# EAGLE design SparkX_smol_ZOE-M8Q (EAGLE 9.6.2)
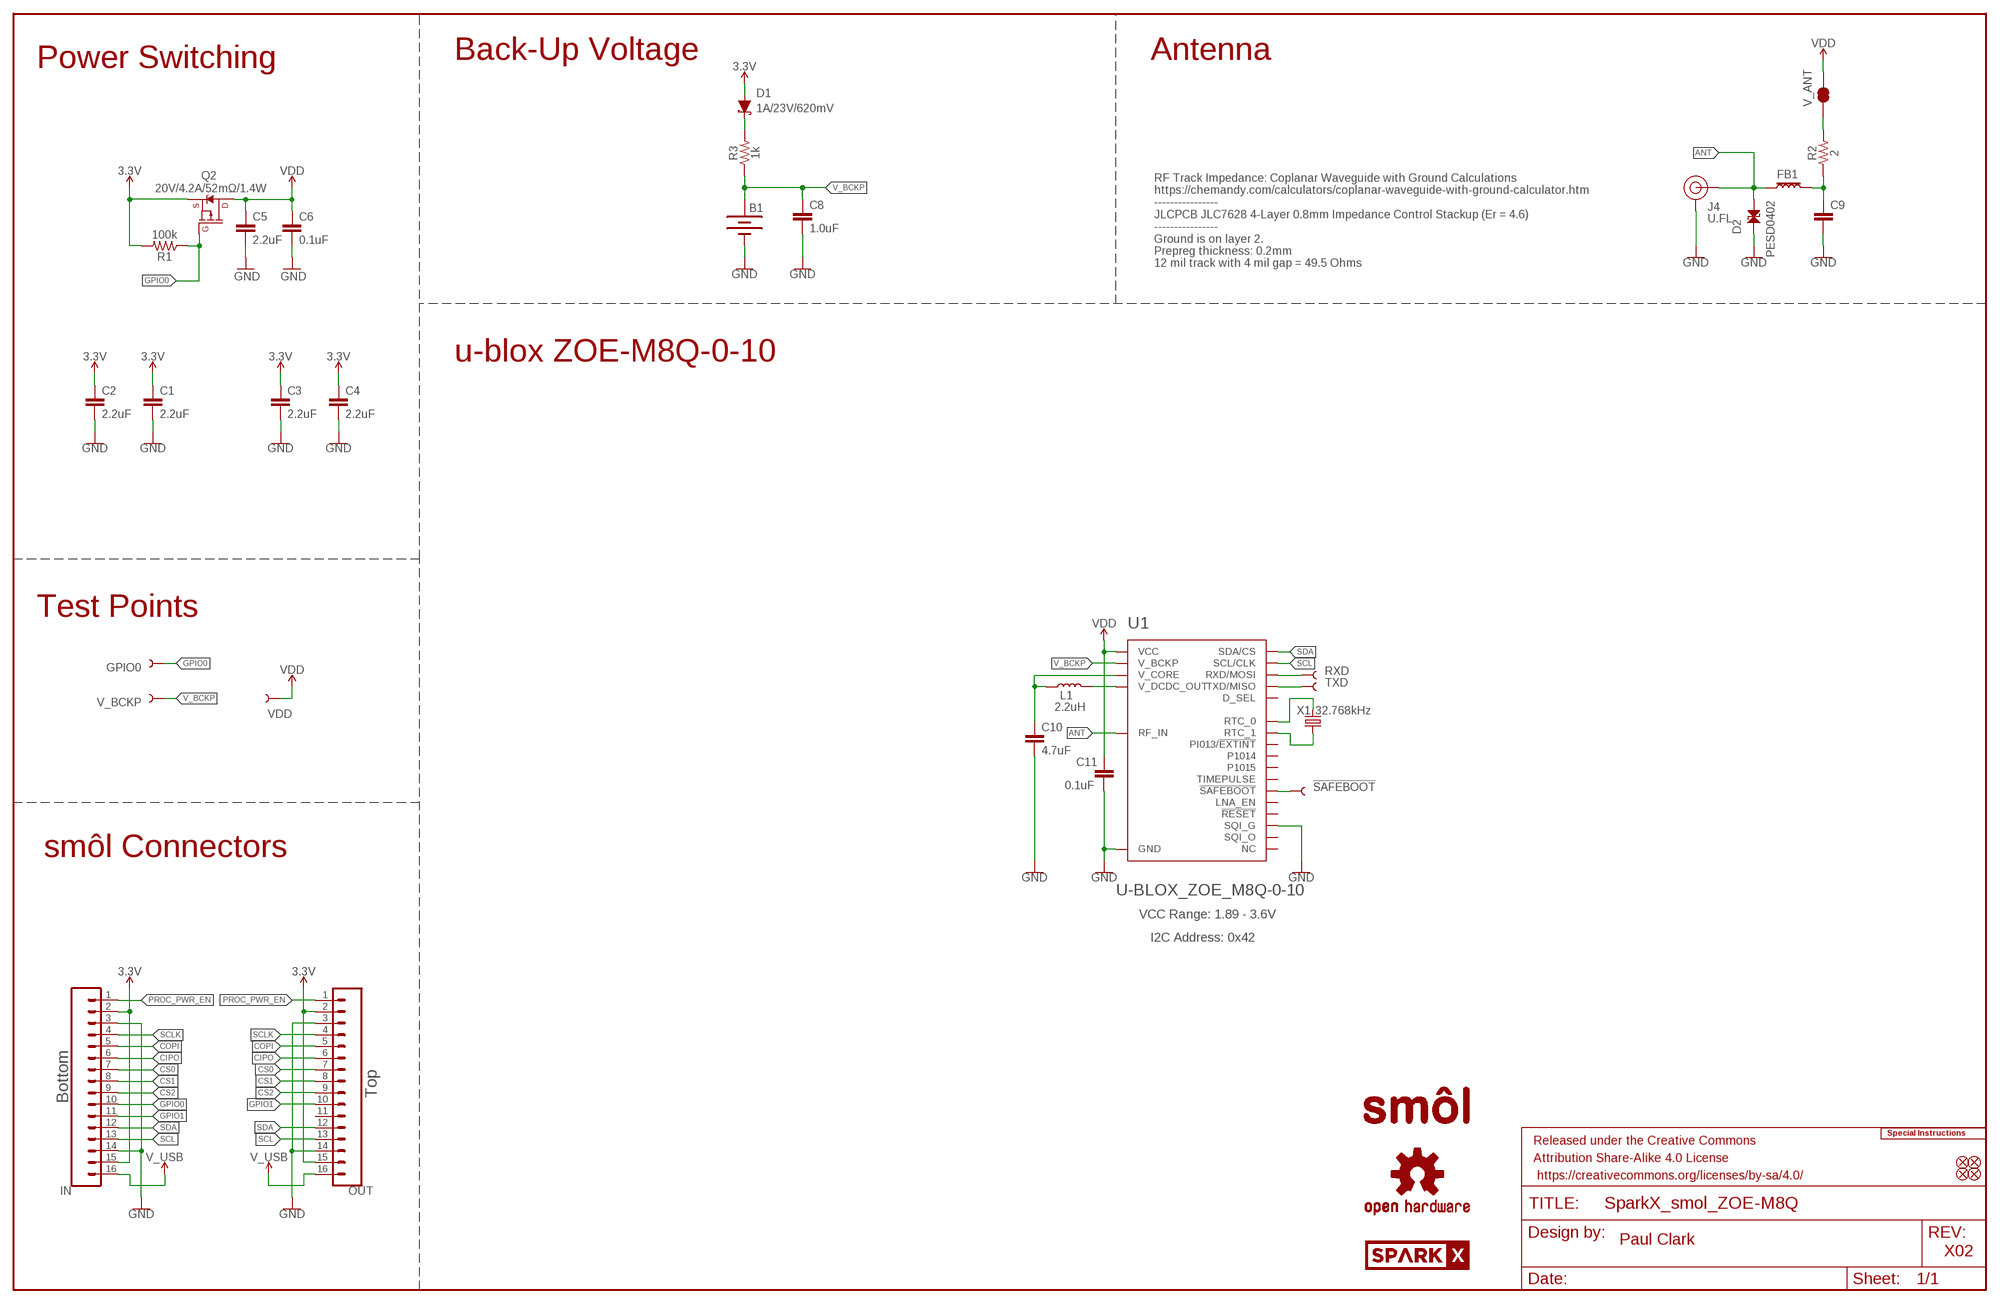
[diagram p0: schematic, sheet 1]

## Parts
!SAFEBOOT!  TEST-POINT3  [PAD.03X.03]
B1  6.8MM_COIN_CELL  ML414H_IV01E_BATTERY  [ML414H_IV01E]
C1  2.2uF  2.2UF-0402_TIGHT-10V-10%-X5R  [0402-TIGHT]
C2  2.2uF  2.2UF-0402_TIGHT-10V-10%-X5R  [0402-TIGHT]
C3  2.2uF  2.2UF-0402_TIGHT-10V-10%-X5R  [0402-TIGHT]
C4  2.2uF  2.2UF-0402_TIGHT-10V-10%-X5R  [0402-TIGHT]
C5  2.2uF  2.2UF-0402_TIGHT-10V-10%-X5R  [0402-TIGHT]
C6  0.1uF  0.1UF-0402T-10V-10%-X7R  [0402-TIGHT]
C8  1.0uF  1.0UF-0402T-16V-10%  [0402-TIGHT]
C9  47PF-0402_TIGHT-25V-5%-X7R  [0402-TIGHT]
C10  4.7uF  4.7UF-0402_TIGHT-6.3V-20%-X5R  [0402-TIGHT]
C11  0.1uF  0.1UF-0402T-6.3V-10%-X7R  [0402-TIGHT]
D1  1A/23V/620mV  DIODE-SCHOTTKY-BAT20J  [SOD-323]
D2  PESD0402  [0402]
FB1  FERRITE_BEAD-120_OHM-0402  [0402]
FD1  FIDUCIALUFIDUCIAL  [FIDUCIAL-MICRO]
FD2  FIDUCIALUFIDUCIAL  [FIDUCIAL-MICRO]
FD3  FIDUCIALUFIDUCIAL  [FIDUCIAL-MICRO]
FD4  FIDUCIALUFIDUCIAL  [FIDUCIAL-MICRO]
FRAME1  FRAME-LEDGER  [CREATIVE_COMMONS]
GPIO0  TEST-POINT3  [PAD.03X.03]
IN  CONN_16FPC_16_0.5MM  [FPC_16_0.5MM]
J4  U.FL  U.FL2PIN  [U.FL]
L1  2.2uH  2.2μH_SHIELDED_INDUCTOR  [0806]
LOGO1  SPECIAL_INSTRUCTIONS-ORDERING  [ORDERING_INSTRUCTIONS]
LOGO2  OSHW-LOGOMINI  [OSHW-LOGO-MINI]
LOGO3  OSHW-LOGOMINI  [OSHW-LOGO-MINI]
OUT  CONN_16FPC_16_0.5MM  [FPC_16_0.5MM]
Q2  20V/4.2A/52mΩ/1.4W  MOSFET_PCH-DMG2305UX-7  [SOT23-3]
R1  100k  100KOHM-0402T-1/16W-1%  [0402-TIGHT]
R2  2  2OHM-0402T-1/16W-1%  [0402-TIGHT]
R3  1k  1KOHM-0402T-1/16W-1%  [0402-TIGHT]
RXD  TEST-POINT3  [PAD.03X.03]
TXD  TEST-POINT3  [PAD.03X.03]
U1  U-BLOX_ZOE_M8Q-0-10  [UBLOX_ZOE_M8-0-10]
U$1  SPARKX-LOGO3  [SPARKX-SMALL]
U$3  SMOL_LOGOSMALL  [SMOL_SMALL]
U$4  SPARKX-LOGO3  [SPARKX-SMALL]
U$13  SMOL_LOGOSMALL  [SMOL_SMALL]
V_ANT  JUMPER-SMT_2_NC_TRACE_SILK  [SMT-JUMPER_2_NC_TRACE_SILK]
V_BCKP  TEST-POINT3  [PAD.03X.03]
VDD  TEST-POINT3  [PAD.03X.03]
X1  32.768kHz  CRYSTAL-32.768KHZSMD-3.2X1.5  [CRYSTAL-SMD-3.2X1.5MM]

## Nets
3.3V: C1.1 C2.1 C3.1 C4.1 D1.A IN.2 IN.15 OUT.2 OUT.15 Q2.2(S) R1.2
!SAFEBOOT!: !SAFEBOOT!.1 U1.34(!SAFEBOOT)
ANT: D2.2 FB1.1 J4.FEED(SIGNAL) U1.4(RF_IN)
CIPO: IN.6 OUT.6
COPI: IN.5 OUT.5
CS0: IN.7 OUT.7
CS1: IN.8 OUT.8
CS2: IN.9 OUT.9
GND: B1.- C1.2 C2.2 C3.2 C4.2 C5.2 C6.2 C8.2 C9.2 C10.2 C11.2 D2.1 IN.3 IN.14 J4.1(GND) J4.2(GND) OUT.3 OUT.14 U1.1(GND) U1.3(GND) U1.5(GND) U1.7(GND) U1.8(GND) U1.9(GND) U1.10(GND) U1.11(GND) U1.12(GND) U1.17(GND) U1.23(GND) U1.29(SQI_G) U1.31(SQI_G) U1.37(GND) U1.38(GND) U1.39(GND) U1.40(GND) U1.41(GND) U1.44(GND) U1.46(SQI_G) U1.47(SQI_G) U1.49(GND)
GPIO0: GPIO0.1 IN.10 Q2.1(G) R1.1
GPIO1: IN.11 OUT.10
N$4: R2.2 V_ANT.1
N$6: D1.C R3.2
N$22: L1.2 U1.26(V_DCDC_OUT)
N$23: C10.1 L1.1 U1.27(V_CORE)
N$27: U1.18(RTC_0) X1.P$2
N$32: U1.19(RTC_1) X1.P$1
N$34: C9.1 FB1.2 R2.1
PROC_PWR_EN: IN.1 OUT.1
RXD: RXD.1 U1.22(RXD/MOSI)
SCL: IN.13 OUT.13 U1.32(SCL/CLK)
SCLK: IN.4 OUT.4
SDA: IN.12 OUT.12 U1.2(SDA/CS)
TXD: TXD.1 U1.21(TXD/MISO)
V_BCKP: B1.+ C8.1 R3.1 U1.16(V_BCKP) V_BCKP.1
V_USB: IN.16 OUT.16
VDD: C5.1 C6.1 C11.1 Q2.3(D) U1.24(VCC) U1.25(VCC) V_ANT.2 VDD.1
Unconnected: OUT.11 U1.6(NC) U1.13(NC) U1.14(NC) U1.15(NC) U1.20(!RESET) U1.28(NC) U1.30(SQI_O) U1.33(TIMEPULSE) U1.35(LNA_EN) U1.36(P1015) U1.42(NC) U1.43(PI013/!EXTINT) U1.45(SQI_O) U1.48(D_SEL) U1.50(P1014) U1.51(NC)

## Notes on the sheet
- Power Switching | Back-Up Voltage | Antenna
- RF Track Impedance: Coplanar Waveguide with Ground Calculations
  https://chemandy.com/calculators/coplanar-waveguide-with-ground-calculator.htm
  ----------------
  JLCPCB JLC7628 4-Layer 0.8mm Impedance Control Stackup (Er = 4.6)
  ----------------
  Ground is on layer 2.
  Prepreg thickness: 0.2mm
  12 mil track with 4 mil gap = 49.5 Ohms
- u-blox ZOE-M8Q-0-10
- Test Points
- smôl Connectors
- VCC Range: 1.89 - 3.6V
- I2C Address: 0x42
- Top
- Bottom
- Paul Clark
- X02

## Library data of the parts
!SAFEBOOT! GPIO0 RXD TXD V_BCKP VDD = SparkFun-Connectors:TEST-POINT: SparkFun Test Points Bare copper test points for troubleshooting or In-Circuit-Testing. These are used by our Production team for verifying production board runs using pogo-pins on test beds. SparkFun Products: SparkFun LSM9DS1 Breakout <https://www.sparkfun.com/products/13284> SparkFun PSOC <https://www.sparkfun.com/products/13714> SparkFun Load Cell Amplifier <https://www.sparkfun.com/products/13879>
B1 = SparkFun-Batteries:ML414H_IV01E_BATTERY: SEIKO ML414H-IV01E Reflowable Lithium Battery ML414H is a rechargeable, coin type battery with features such as Pb-free reflowable (Peak temperature: 260 C) and high temperature heat resistance. Battery Characteristics: 3.1V max voltage Voff is 2V 1mAH 3k series resistor with battery 72 hour charge time from 2.0-3.1V 2.3-2.8V initial charge; PROD_ID: BATT-14267
C1-C5 = SparkFun-Capacitors:2.2UF: 2.2µF ceramic capacitors A capacitor is a passive two-terminal electrical component used to store electrical energy temporarily in an electric field.; PROD_ID: CAP-14232
C6 = SparkFun-Capacitors:0.1UF: 0.1µF ceramic capacitors A capacitor is a passive two-terminal electrical component used to store electrical energy temporarily in an electric field.; PROD_ID: CAP-15083
C8 = SparkFun-Capacitors:1.0UF: 1µF ceramic capacitors A capacitor is a passive two-terminal electrical component used to store electrical energy temporarily in an electric field.; PROD_ID: CAP-12417
C9 = SparkFun-Capacitors:47PF: 47pF ceramic capacitors A capacitor is a passive two-terminal electrical component used to store electrical energy temporarily in an electric field.; PROD_ID: CAP-15063
C10 = SparkFun-Capacitors:4.7UF: 4.7µF ceramic capacitors A capacitor is a passive two-terminal electrical component used to store electrical energy temporarily in an electric field.; PROD_ID: CAP-14240
C11 = SparkFun-Capacitors:0.1UF: 0.1µF ceramic capacitors A capacitor is a passive two-terminal electrical component used to store electrical energy temporarily in an electric field.; PROD_ID: CAP-14993
D1 = SparkFun-DiscreteSemi:DIODE-SCHOTTKY: Schottky diode A Schottky diode is a semiconductor diode which has a low forward voltage drop and a very fast switching action.; PROD_ID: DIO-11623
D2 = SparkFun-DiscreteSemi:PESD0402: ESD protection diode PESD is used to protect a signal line from ESD.; DIGIKEY_PART: PESD0402-140CT-ND; MOUSE_PART: 650-PESD0402-140; PROD_ID: DIO-15359
FB1 = SparkFun-Coils:FERRITE_BEAD-120_OHM: Ferrite Bead (blocks, cores, rings, chokes, etc.) Inductor with layers of ferrite used to suppress high frequencies. Often used to isolate high frequency noise.; MFG_PART: BLM15HB121SN1D; PROD_ID: NDUC-14206
FD1-FD4 = SparkFun-Aesthetics:FIDUCIAL: Fiducial Alignment Points Point-of-reference for pick-and-place machines and other optical instruments.
FRAME1 = SparkFun-Aesthetics:FRAME-LEDGER: Schematic Frame - Ledger Standard 11x14 US Ledger frame
IN OUT = SparkFun-Connectors:CONN_16: Multi connection point. Often used as Generic Header-pin footprint for 0.1 inch spaced/style header connections On any of the 0.1 inch spaced packages, you can populate with these: Break Away Headers - Straight <https://www.sparkfun.com/products/116> (PRT-00116) Break Away Male Headers - Right Angle <https://www.sparkfun.com/products/553> (PRT-00553) Female Headers <https://www.sparkfun.com/products/115> (PRT-00115) Break Away Headers - Machine Pin <https://www.sparkfun.com/products/117> (PRT-00117) Break Away Female Headers - Swiss Machine Pin <https://www.sparkfun.com/products/743> (PRT-00743) For SCREWTERMINALS and SPRING TERMINALS visit here: Screw Terimnals on SparkFun.com <https://www.sparkfun.com/search/results?term=Screw+Terminals> (5mm/3.5mm/2.54mm spacing) This device is also useful as a general connection point to wire up your design to another part of your project. Our various solder wires solder well into these plated through hole pads. Hook-Up Wire - Assortment (Stranded, 22 AWG) <https://www.sparkfun.com/products/11375> (PRT-11375) Hook-Up Wire - Assortment (Solid Core, 22 AWG) <https://www.sparkfun.com/products/11367> (PRT-11367) View the entire wire category on our website here <https://www.sparkfun.com/categories/141> Special notes: Molex polarized connector foot print use with SKU : PRT-08231 with associated crimp pins and housings. 1MM SMD Version SKU: PRT-10208 NOTES ON THE VARIANTS LOCK and LOCK_LONGPADS... This footprint was designed to help hold the alignment of a through-hole component (i.e. 6-pin header) while soldering it into place. You may notice that each hole has been shifted either up or down by 0.005 of an inch from it's more standard position (which is a perfectly straight line). This slight alteration caused the pins (the squares in the middle) to touch the edges of the holes. Because they are alternating, it causes a "brace" to hold the component in place. 0.005 has proven to be the perfect amount of "off-center" position when using our standard breakaway headers. Although looks a little odd when you look at the bare footprint, once you have a header in there, the alteration is very hard to notice. Also,if you push a header all the way into place, it is covered up entirely on the bottom side.; PROD_ID: CONN-16066
J4 = SparkFun-Connectors:U.FL2PIN: SMD Antenna Connector - U.FL 2mm height, 3.0mm x 3.0mm receptacle size. SparkFun Products: SparkFun WiFi Shield - ESP8266 <https://www.sparkfun.com/products/13287> SparkFun ESP8266 Thing <https://www.sparkfun.com/products/13231> SparkFun MiniGen - Pro Mini Signal Generator Shield <https://www.sparkfun.com/products/11420>; PROD_ID: CONN-09193; SF_ID: WRL-09144
L1 = SparkFun-Coils:2.2μH_SHIELDED_INDUCTOR: Murata 2.2uH Inductor 2.2uH 1.2A 110mOhm 0806 Package Shielded Bourns 2.2uH Inductor 2.2uH 5.5A 205mOhm 5x5mm Package Shielded; PROD_ID: NDUC-14257
LOGO1 = SparkFun-Aesthetics:SPECIAL_INSTRUCTIONS: Special Ordering/Production Instructions Alert Symbol for special PCB ordering instructions or unique production process warnings. Ordering Instructions Production Instructions Types of information that should be added to box: Copper weight Soldermask color Silk color PCB thickness Number of layers PCB Standard: 1.6mm FR4 1 oz copper immersion silver plating red soldermask white silkscreen Types of information that should be added to box: Special wash requirements Depaneling instructions Humidification Glue curing Default text settings: 0.07 inch 9% ratio 50% line distance
LOGO2 LOGO3 = SparkFun-Aesthetics:OSHW-LOGO: Open-Source Hardware (OSHW) Logo This logo indicates the piece of hardware it is found on incorporates a OSHW license and/or adheres to the definition of open source hardware found here: http://freedomdefined.org/OSHW
Q2 = SparkFun-DiscreteSemi:MOSFET_PCH: P-channel MOSFETs Voltage controlled devices that allow control of high current outputs. SparkFun Products: SparkFun ESP32 Thing <https://www.sparkfun.com/products/13907> SparkFun ESP8266 Thing <https://www.sparkfun.com/products/13231> SparkFun Pi Servo HAT V2 <https://www.sparkfun.com/products/15316> DMG2305UX-7 (20V/4.2A/SOT23-3); PROD_ID: TRANS-14388
R1 = SparkFun-Resistors:100KOHM: 100kΩ resistor A resistor is a passive two-terminal electrical component that implements electrical resistance as a circuit element. Resistors act to reduce current flow, and, at the same time, act to lower voltage levels within circuits. - Wikipedia; PROD_ID: RES-13495
R2 = SparkFun-Resistors:2OHM: 2 Ω resistor A resistor is a passive two-terminal electrical component that implements electrical resistance as a circuit element. Resistors act to reduce current flow, and, at the same time, act to lower voltage levels within circuits. - Wikipedia; PROD_ID: RES-15724
R3 = SparkFun-Resistors:1KOHM: 1kΩ resistor A resistor is a passive two-terminal electrical component that implements electrical resistance as a circuit element. Resistors act to reduce current flow, and, at the same time, act to lower voltage levels within circuits. - Wikipedia; PROD_ID: RES-14342
U1 = SparkFun-GPS:U-BLOX_ZOE_M8Q-0-10: UBLOX ZOE-M8Q-0-10 u-blox ZOE-M8 standard precision GNSS SiP (System in Package) modules feature the high performance u-blox M8 GNSS engine. ZOE-M8’s ultra-miniature form factor integrates a complete GNSS receiver including SAW filter, LNA and TCXO. Handles all GNSS systems and can simulatenously use up to three of them, with accuracy ranging from 2.5m to 4m. GPS GLONASS BeiDou Galileo This can be corrected with the SBAS or QZSS augmentation systems.; PROD_ID: IC-14251
U$1 U$4 = SparkX:SPARKX-LOGO
U$3 U$13 = SparkX:SMOL_LOGO
V_ANT = SparkFun-Jumpers:JUMPER-SMT_2_NC_TRACE: Normally closed trace jumper This jumper has a trace between two pads so it's normally closed (NC). Use a razor knife to open the connection. For best results follow the IPC guidelines for cutting traces: Cutout at least 0.063 mm (0.005 in). Remove all loose material to clean up the cut area. Seal the cut with an approved epoxy. Reapply solder to reclose the connection.
X1 = SparkFun-Clocks:CRYSTAL-32.768KHZ: 32.768kHz Crystal Frequency: 32.768kHz Frequency Stability: ±20ppm Load Capacitance: 12.5pF (PTH-2X6 & SMD-3.2X1.5), 6pF (SMD-2X6) SparkFun Products: SparkFun BigTime Watch Kit <https://www.sparkfun.com/products/11734> SparkFun nRF52832 Breakout <https://www.sparkfun.com/products/13990> SparkFun Real Time Clock Module <https://www.sparkfun.com/products/12708>; PROD_ID: XTAL-13062

## Net classes
1 Power: width 0.305 mm
2 3.3V: width 0.508 mm

## Board
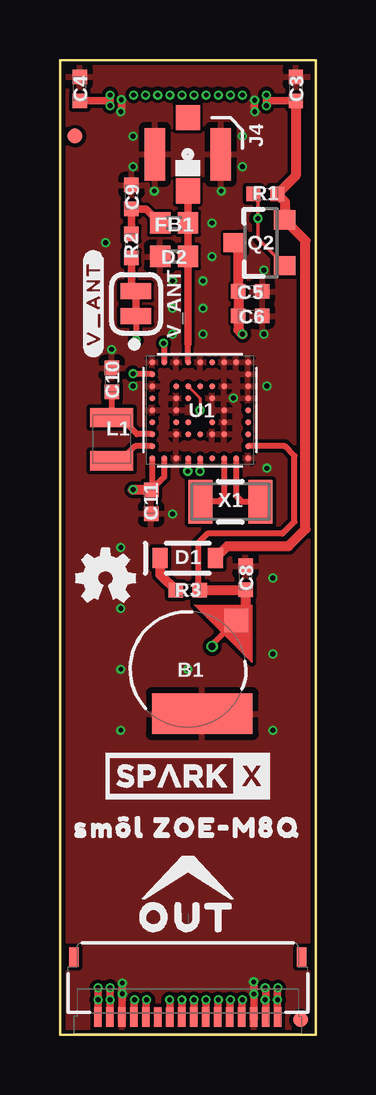
[diagram p1: board, top side]
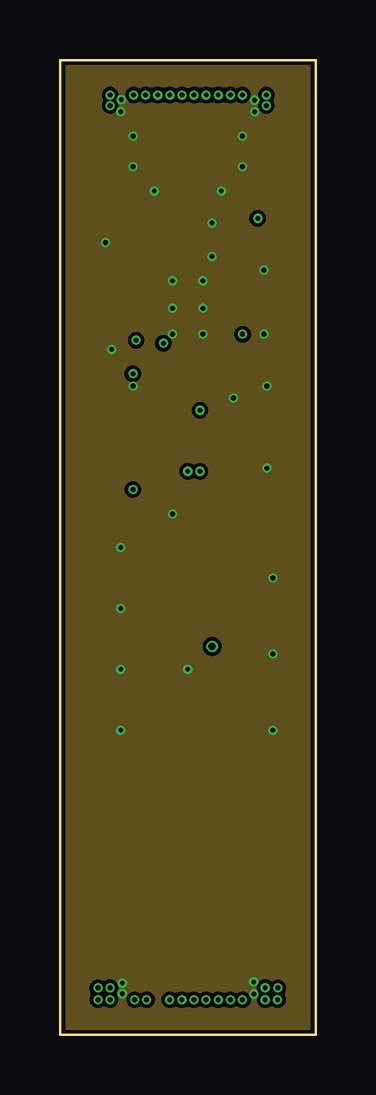
[diagram p2: board, inner layer Route2]
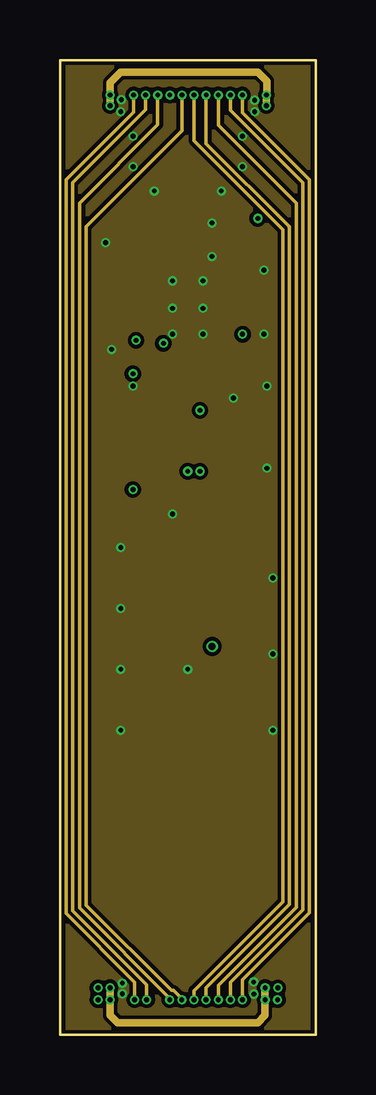
[diagram p3: board, inner layer Route15]
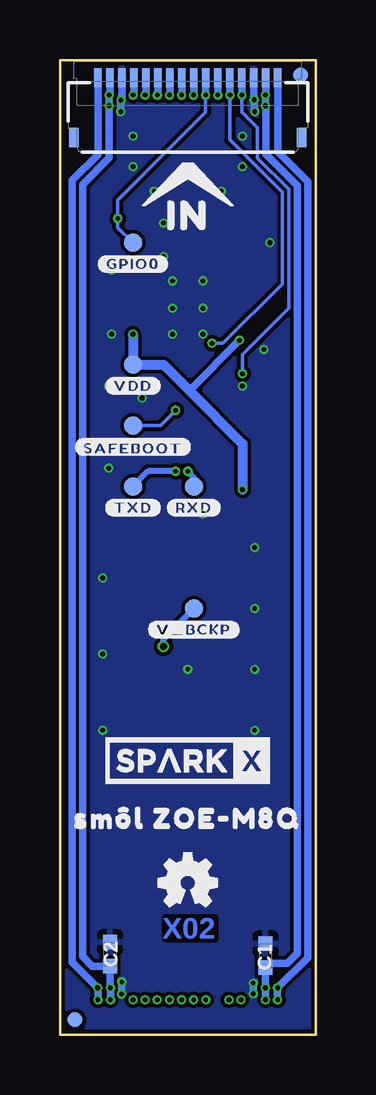
[diagram p4: board, bottom side, seen from below]

Size 10.67 x 40.64 mm. Coordinates in mm from the lower left corner, seen from the top.
Outline: 0,40.64 0,0 10.67,0 10.67,40.64 0,40.64
Copper layers (1+2*15+16): Top 0.035mm / dielectric 0.2mm / Route2 0.0175mm / dielectric 0.265mm / Route15 0.0175mm / dielectric 0.2mm / Bottom 0.035mm
Design rules "SparkFun-4_layer-Impedance_Control-JLCPCB-JLC7628": minimum track width 5mil, minimum drill 0.2mm, track to track 5mil, track to pad 5mil, pad to pad 5mil, via to via 5mil, smd to smd 0mil, copper to edge 5mil, drill to drill 5mil, minimum pad ring 3.5mil, minimum via ring 3.5mil, stop-mask expansion 2.5mil, vias tented up to drill 25mil, thermal gap 10mil

### Footprints (pad centres in the part's own frame; a part is rotated, then mirrored left to right if it is on the bottom)
PAD.03X.03 = smd 0.762 x 0.762: 1 0,0
ML414H_IV01E = smd 1 x 1: + 2.022,2.032 | smd 4.2 x 1.7: - 0.6,-1.85
0402-TIGHT = smd 0.6 x 0.6: 1 -0.5,0; 2 0.5,0
SOD-323 = smd 0.63 x 0.83: A 1.15,0; C -1.15,0
0402 = smd 0.85 x 0.9: 1 -0.58,0; 2 0.58,0
FIDUCIAL-MICRO = smd 0.635 x 0.635: 1 0,0
FPC_16_0.5MM = smd 0.3 x 0.8: 1 -3.75,1.35; 2 -3.25,1.35; 3 -2.75,1.35; 4 -2.25,1.35; 5 -1.75,1.35; 6 -1.25,1.35; 7 -0.75,1.35; 8 -0.25,1.35; 9 0.25,1.35; 10 0.75,1.35; 11 1.25,1.35; 12 1.75,1.35; 13 2.25,1.35; 14 2.75,1.35; 15 3.25,1.35; 16 3.75,1.35 | smd 0.4 x 0.8: MP1 -4.75,-1.15; MP2 4.75,-1.15
U.FL = smd 2.2 x 0.85: 1 0,1.375; 2 0,-1.375 | smd 1.05 x 1: FEED 1.525,0; NC -1.525,0
0806 = smd 0.8 x 1.8: 1 -0.9,0; 2 0.9,0
SOT23-3 = smd 0.8 x 0.9: 1 -0.95,-1; 2 0.95,-1; 3 0,1.1
UBLOX_ZOE_M8-0-10 = smd 0.25 x 0.25: 1 -1.996,2.004; 2 -1.496,2.004; 3 -0.996,2.004; 4 -0.496,2.004; 5 0.004,2.004; 6 0.504,2.004; 7 1.004,2.004; 8 1.504,2.004; 9 2.004,2.004; 10 2.004,1.504; 11 2.004,1.004; 12 2.004,0.504; 13 2.004,0.004; 14 2.004,-0.496; 15 2.004,-0.996; 16 2.004,-1.496; 17 2.004,-1.996; 18 1.504,-1.996; 19 1.004,-1.996; 20 0.504,-1.996; 21 0.004,-1.996; 22 -0.496,-1.996; 23 -0.996,-1.996; 24 -1.496,-1.996; 25 -1.996,-1.996; 26 -1.996,-1.496; 27 -1.996,-0.996; 28 -1.996,-0.496; 29 -1.996,0.004; 30 -1.996,0.504; 31 -1.996,1.004; 32 -1.996,1.504; 33 -0.996,1.004; 34 -0.496,1.004; 35 0.004,1.004; 36 0.504,1.004; 37 1.004,1.004; 38 1.004,0.004; 39 1.004,-0.496; 40 1.004,-0.996; 41 0.504,-0.996; 42 0.004,-0.996; 43 -0.496,-0.996; 44 -0.996,-0.996; 45 -0.996,-0.496; 46 -0.996,0.004; 47 -0.996,0.504; 48 -0.496,0.504; 49 0.504,0.504; 50 0.504,-0.496; 51 -0.496,-0.496
SMT-JUMPER_2_NC_TRACE_SILK = smd 0.66 x 1.27: 1 -0.521,0; 2 0.521,0
CRYSTAL-SMD-3.2X1.5MM = smd 1 x 1.8: P$1 -1.25,0; P$2 1.25,0

### Placement (x,y rotation side)
!SAFEBOOT!  7.62,25.4 0 bottom
B1  5.33,15.24 0 top
C1  2.1,3.3 90 bottom
C2  8.57,3.37 90 bottom
C3  9.84,39.43 90 top
C4  0.83,39.43 90 top
C5  7.94,30.99 0 top
C6  7.94,29.97 0 top
C8  7.75,19.05 90 top
C9  2.98,34.92 90 top
C10  2.16,27.3 90 top
C11  3.81,22.23 270 top
D1  5.33,19.88 0 top
D2  4.76,32.45 0 top
FB1  4.76,33.85 180 top
FD1  0.64,37.47 0 top
FD2  0.64,40.01 0 bottom
FD3  10.03,0.64 0 top
FD4  10.03,0.64 0 bottom
FRAME1  45.72,-10.16 0 top  (outside the outline)
GPIO0  7.62,33.02 0 bottom
IN  5.33,38.54 0 bottom
J4  5.33,36.7 270 top
L1  2.16,24.83 270 top
LOGO1  19.05,50.8 0 top  (outside the outline)
LOGO2  1.91,19.05 0 top
LOGO3  5.33,6.35 0 bottom
OUT  5.33,2.1 180 top
Q2  8.38,33.02 90 top
R1  8.57,35.05 0 top
R2  2.98,32.89 270 top
R3  5.33,18.54 180 top
RXD  5.08,22.86 0 bottom
TXD  7.62,22.86 0 bottom
U1  5.84,26.04 0 top
U$1  5.33,10.79 0 top
U$2  [SM�L_ZOE#M8Q0]  5.33,9.02 0 bottom
U$3  5.33,6.79 0 top
U$4  5.33,11.43 0 bottom
U$5  [#V_ANT#0]  1.4,30.48 90 top
U$6  [#VDD#0]  7.62,27.05 0 bottom
U$7  [##SAFEBOOT##0]  7.62,24.51 0 bottom
U$8  [#TXD#0]  7.62,21.97 0 bottom
U$9  [#RXD#0]  5.08,21.97 0 bottom
U$10  [#GPIO0#0]  7.62,32.13 0 bottom
U$11  [#V_BCKP#0]  5.08,16.89 0 bottom
U$12  [SM�L_ZOE#M8Q0]  5.33,8.64 0 top
U$13  5.33,35.69 0 bottom
U$14  [OUT0]  5.33,4.89 0 top
U$15  [IN0]  5.33,34.16 0 bottom
V_ANT  3.17,30.48 270 top
V_BCKP  5.08,17.78 0 bottom
VDD  7.62,27.94 0 bottom
X1  7.11,22.23 0 top

### Tracks (layer width: path | path; a pad name or v marks a point on that pad's centre or on a via)
3.3V  (via drill 0.2)
  Top 0.305: OUT.2 8.58,1.95 v8.56,1.97 | v8.62,39.18 8.62,38.92 | 8.62,38.92 v8.62,38.73 | C3.1 8.62,38.93 8.62,38.92 | v2.1,39.18 2.1,38.92 | 2.1,38.92 v2.1,38.73 | C4.1 2.09,38.93 2.1,38.92 | OUT.15 2.08,1.45 v2.1,1.46 v2.09,1.46 v2.09,1.97
  Top 0.406: C3.1 9.84,35.82 R1.2 9.38,34.74 Q2.2 10.24,33.11 10.24,21.08 9.53,20.37 6.98,20.37 D1.A
  Route15 0.305: v2.09,1.97 v2.1,1.97 v2.1,1.46 2.1,0.83 2.41,0.51 8.26,0.51 8.56,0.81 v8.56,1.46 v8.56,1.97 | v2.1,38.73 v2.1,39.18 2.1,39.69 2.54,40.13 8.26,40.13 8.64,39.75 8.64,39.2 v8.62,39.18 v8.62,38.73
  Bottom 0.305: v8.56,1.46 v8.56,1.97 8.57,1.98 C2.1 9.33,2.87 9.73,3.27 9.73,35.45 8.62,36.56 v8.62,38.73 v8.62,39.18 8.58,39.21 IN.2 | v2.1,1.46 v2.1,1.97 v2.09,1.97 C1.1 1.91,2.98 1.17,2.98 0.76,3.39 0.76,35.39 2.07,36.7 2.07,38.67 2.1,38.7 v2.1,38.73 v2.1,39.18 2.08,39.19 IN.15
  Bottom 0.406: C2.1 8.58,2.86
!SAFEBOOT!  (via drill 0.2)
  Top 0.127: U1.34 5.84,26.54 v5.84,26.04
  Bottom 0.152: !SAFEBOOT!.1 6.48,25.4 v5.84,26.04
ANT
  Top 0.254: U1.4 5.35,28.82
  Top 0.305: FB1.1 | FB1.1 J4.FEED | FB1.1 D2.2 5.35,28.82
CIPO  (via drill 0.2)
  Top 0.305: v6.61,1.46 6.58,1.44 OUT.6
  Route15 0.152: v6.61,39.18 6.61,37.92 9.86,34.67 9.86,5.32 6.61,2.07 v6.61,1.46
  Bottom 0.305: IN.6 6.58,39.2 v6.61,39.18
COPI  (via drill 0.2)
  Top 0.305: v7.11,1.46 7.08,1.43 OUT.5
  Route15 0.152: v7.11,39.18 7.11,38.55 10.13,35.52 10.13,5.21 7.11,2.18 v7.11,1.46
  Bottom 0.305: IN.5 7.08,39.21 v7.11,39.18
CS0  (via drill 0.2)
  Top 0.305: OUT.7 6.08,1.45 v6.1,1.46
  Route15 0.152: v6.1,39.18 6.1,37.16 9.58,33.69 9.58,5.44 6.1,1.96 v6.1,1.46
  Bottom 0.305: IN.7 6.08,39.2 v6.1,39.18
CS1  (via drill 0.2)
  Top 0.305: OUT.8 v5.58,1.45 v5.59,1.46
  Route15 0.152: v5.6,39.18 5.6,37.27 9.3,33.57 9.3,5.55 5.59,1.85 v5.59,1.46
  Bottom 0.305: IN.8 5.58,39.19 v5.6,39.18
CS2  (via drill 0.2)
  Top 0.305: OUT.9 v5.08,1.46 v5.09,1.46
  Route15 0.152: v5.09,1.46 5.09,1.51 4.74,1.85 4.65,1.85 1.09,5.41 1.09,33.69 5.09,37.68 v5.09,39.18
  Bottom 0.305: IN.9 v5.08,39.19 v5.09,39.18
GND  (via drill 0.2)
  Top 0.305: v8.12,38.96 v8.12,38.48 v8.13,38.48 | v2.56,38.99 2.56,38.51 v2.54,38.48 | OUT.14 2.58,1.7 v2.6,1.71 v2.6,2.16 | OUT.3 8.08,1.26 8.09,1.27 v8.09,1.7 v8.08,1.71 v8.08,2.21
  Bottom 0.305: IN.3 8.08,39 v8.12,38.96 v8.13,38.95 v8.13,38.48 | IN.14 2.58,39.01 v2.56,38.99 2.56,38.51 v2.54,38.48 | v2.6,1.71 v2.6,2.16 | v8.09,1.7 8.09,2.2 v8.08,2.21
  other vias: 7.62,37.47 7.62,36.2 3.05,36.2 3.05,37.47 3.94,35.18 6.73,35.18 8.51,31.88 8.51,29.21 6.35,33.85 5.97,31.43 5.97,29.21 5.97,30.29 4.7,29.21 4.7,30.29 4.7,31.43 2.16,28.57 8.89,19.05 3.05,27.05 8.64,27.05 8.64,23.62 4.7,21.72 1.91,33.02 2.54,17.78 2.54,20.32 5.33,15.24 7.24,26.54 2.54,15.24 2.54,12.7 8.89,12.7 8.89,15.88 6.35,32.45
  pour Top (isolate 0.152, rank 3): 0,40.64 10.67,40.64 10.67,0 0,0
  pour Route2 (isolate 0.152, rank 2): 0,40.64 10.67,40.64 10.67,0 0,0
  pour Route15 (isolate 0.152, rank 2): 0,40.64 10.67,40.64 10.67,0 0,0
  pour Bottom (isolate 0.152, rank 2): 0,40.64 10.67,40.64 10.67,0 0,0
  pour Top (isolate 0.102): 3.3,39.12 7.37,39.12 7.37,27.43 3.3,27.43
GPIO0  (via drill 0.2)
  Top 0.152: R1.1 8.26,34.87 8.26,34.29 v8.26,34.04 8.26,33.2 Q2.1
  Bottom 0.152: v4.59,39.18 4.59,38.47 8.26,34.8 v8.26,34.04 8.26,33.66 GPIO0.1
  Bottom 0.305: IN.10 v4.59,39.18
GPIO1  (via drill 0.2)
  Top 0.305: OUT.10 v4.58,1.46
  Route15 0.152: v4.08,39.18 4.08,37.95 0.81,34.67 0.81,5.29 4.58,1.53 v4.58,1.46
  Bottom 0.305: IN.11 v4.08,39.18
N$4
  Top 0.305: V_ANT.1 2.98,31.19 R2.2
N$6
  Top 0.406: D1.C 4.18,19.19 R3.2
N$22
  Top 0.254: U1.26 3.14,24.54 2.53,23.93 L1.2
N$23
  Top 0.254: C10.1 L1.1 2.53,25.73 3.22,25.04 U1.27
N$27
  Top 0.254: U1.18 7.35,22.48 7.6,22.23 X1.P$2
N$32
  Top 0.254: U1.19 6.85,22.45 6.62,22.23 X1.P$1
N$34
  Top 0.305: FB1.2 3.6,34.42 C9.1 R2.1
PROC_PWR_EN  (via drill 0.2)
  Top 0.305: OUT.1 v9.08,1.46 9.08,1.95 v9.09,1.96
  Bottom 0.305: v9.08,1.46 9.08,1.95 v9.09,1.96 10.16,3.02 10.16,35.62 9.08,36.7 IN.1
RXD  (via drill 0.2)
  Top 0.254: U1.22 5.35,23.51 v5.33,23.5
  Bottom 0.254: v5.33,23.5 5.08,23.24 RXD.1
SCL  (via drill 0.2)
  Top 0.254: U1.32 3.07,27.54 v3.05,27.56
  Top 0.305: OUT.13 3.08,1.43 v3.12,1.46
  Route15 0.152: v3.07,39.18 3.07,38.46 0.25,35.64 0.25,5.06 3.12,2.2 v3.12,1.46
  Bottom 0.152: v3.05,27.56 3.05,28.36 1.12,30.29 1.12,35.25 2.43,36.56 2.43,37.81 3.07,38.46 v3.07,39.18
  Bottom 0.305: IN.13 v3.07,39.18
SCLK  (via drill 0.2)
  Top 0.305: v7.62,1.46 7.58,1.43 OUT.4
  Route15 0.152: v7.62,1.46 7.62,2.3 10.41,5.09 10.41,35.64 7.62,38.44 v7.62,39.18
  Bottom 0.305: v7.62,39.18 7.58,39.21 IN.4
SDA  (via drill 0.2)
  Top 0.254: v4.32,28.83 4.35,28.8 U1.2
  Top 0.305: OUT.12 3.58,1.43 v3.62,1.46
  Route15 0.152: v3.62,1.46 3.62,2.09 0.53,5.18 0.53,35.52 3.58,38.57 v3.58,39.18
  Bottom 0.152: v3.58,39.18 3.58,37.31 1.4,35.13 1.4,31.29 3.86,28.83 v4.32,28.83
  Bottom 0.305: IN.12 v3.58,39.19 v3.58,39.18
TXD  (via drill 0.2)
  Top 0.254: U1.21 v5.85,23.5 v5.84,23.5
  Bottom 0.254: v5.84,23.5 6.99,23.5 TXD.1
V_BCKP  (via drill 0.3)
  Top 0.254: U1.16 9.38,24.54 9.79,24.13 9.79,21.4 9.28,20.89 6.16,20.89 5.77,20.5 5.77,18.61 R3.1 | B1.+ 6.35,16.27 v6.35,16.19
  Top 0.406: R3.1 C8.1 7.75,17.66 B1.+
  Bottom 0.254: v6.35,16.19 6.35,16.51 V_BCKP.1
V_USB  (via drill 0.2)
  Top 0.305: OUT.16 v1.59,1.46 v1.59,1.96
  Bottom 0.305: IN.16 1.58,36.83 0.33,35.57 0.33,3.21 v1.59,1.96 v1.59,1.46
VDD  (via drill 0.2)
  Top 0.254: U1.25 3.85,22.76 | 3.85,22.76 C11.1 | U1.24 4.35,23.26 3.85,22.76 | V_ANT.2 v3.17,28.96
  Top 0.406: v7.62,29.21 7.44,29.39 C6.1 C5.1 7.44,32.86 Q2.3 | v3.05,22.73 C11.1 3.85,22.76
  Bottom 0.305: v3.17,28.96 5.27,26.86
  Bottom 0.406: v7.62,29.21 VDD.1 6.35,27.94 5.27,26.86 3.05,24.64 v3.05,22.73

### Text on the board
Bottom: X02
Measures: Dimensions in Inches
tDocu: JLCPCB JLC7628 4-Layer 0.8mm Impedance Control / 4-Layer Board / 0.8mm Thickness / 1oz Copper (Outer layers) / ENIG Finish | Paul Clark